# Altium schematic sheet 600米舵机驱动接口板v1.0.SchDoc
size A4; SheetNumber: 1; SheetTotal: 1
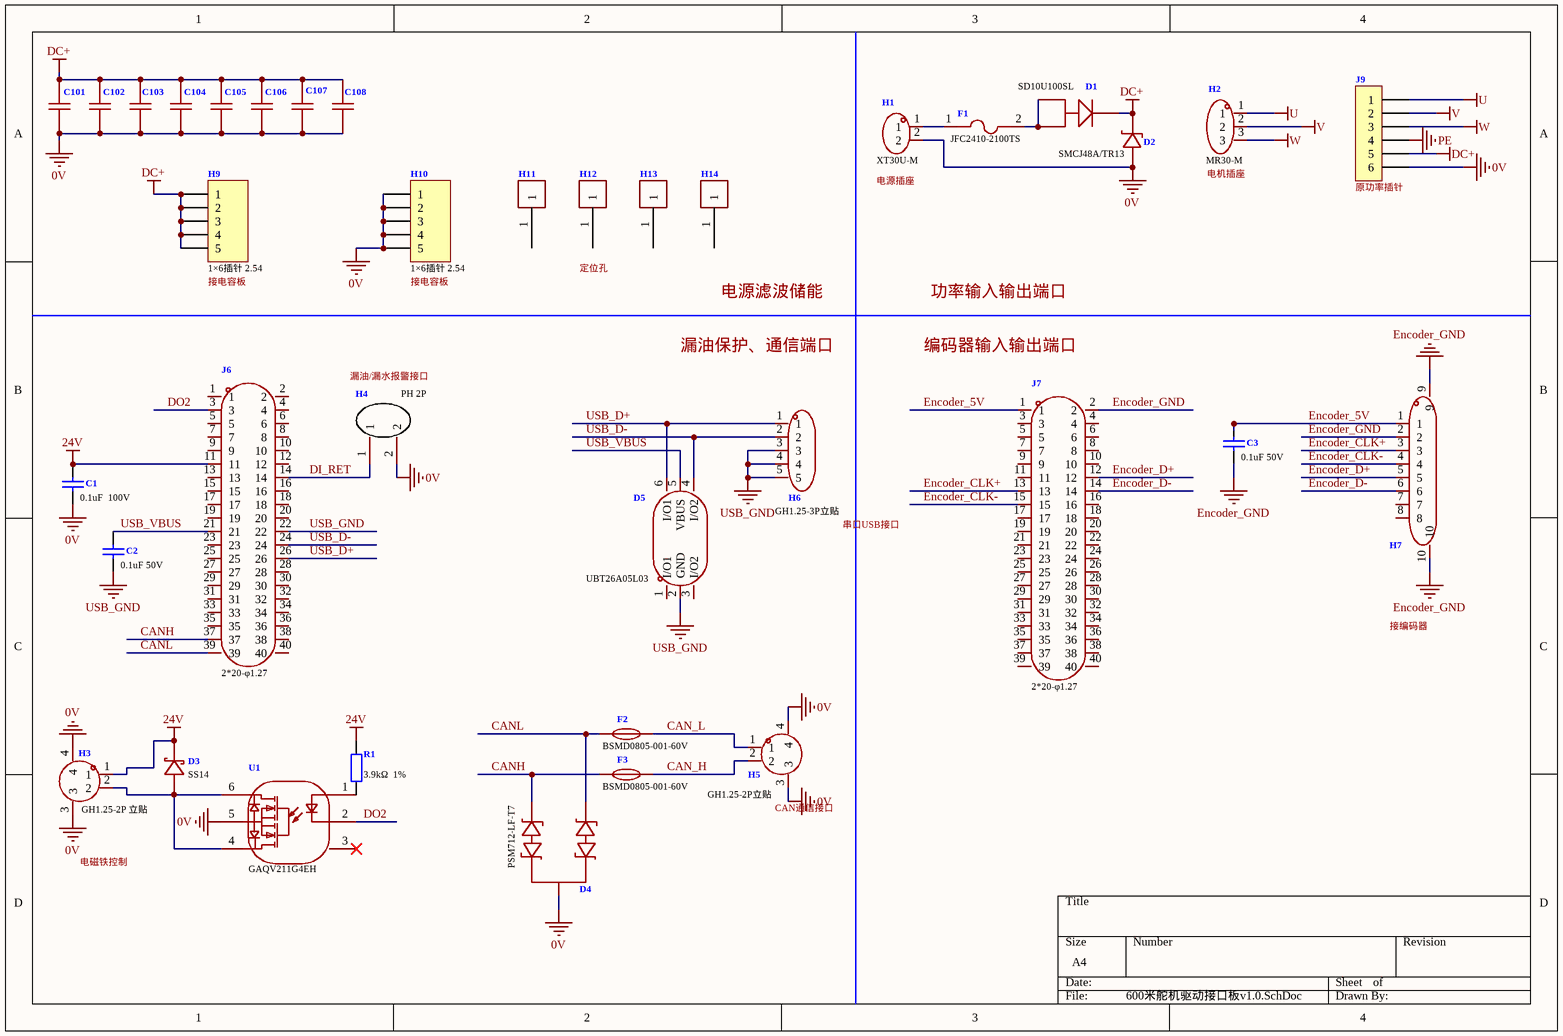
[diagram p0: 600米舵机驱动接口板v1.0.SchDoc]

## Parts
C1  0.1uF  100V  [0805_C]
C2  0.1uF 50V  [0805_C]
C3  0.1uF 50V  [0805_C]
C101  4.7uf 100V  [1210_C]  (value not drawn)
C102  4.7uf 100V  [1210_C]  (value not drawn)
C103  4.7uf 100V  [1210_C]  (value not drawn)
C104  4.7uf 100V  [1210_C]  (value not drawn)
C105  4.7uf 100V  [1210_C]  (value not drawn)
C106  4.7uf 100V  [1210_C]  (value not drawn)
C107  4.7uf 100V  [1210_C]  (value not drawn)
C108  4.7uf 100V  [1210_C]  (value not drawn)
D1  SD10U100SL  [TO-227B-SMD_L6.1-W4.3-LS7.0-RD]
D2  SMCJ48A/TR13  [SMC_L7.1-W6.2-LS8.1-FD]
D3  SS14  [SMAF_L3.5-W2.6-LS4.7-FD]
D4  PSM712-LF-T7  [SOT-23(SOT-23-3)]
D5  UBT26A05L03  [SOT-23-6_L2.9-W1.6-P0.95-LS2.8-BR]
F1  JFC2410-2100TS  [F2410]
F2  BSMD0805-001-60V  [F0805]
F3  BSMD0805-001-60V  [F0805]
H1  XT30U-M  [CONN-TH_XT30U-M-PCB]
H2  MR30-M  [CONN-TH_MR30-M-PCB]
H3  GH1.25-2P 立贴  [CONN-TH_2P-P1.25_XUNPU_WAFER-GH1.25-2PLB]
H4  PH 2P  [CONN-TH_B2B-PH-K-S]
H5  GH1.25-2P立贴  [CONN-TH_2P-P1.25_XUNPU_WAFER-GH1.25-2PLB]
H6  GH1.25-3P立贴  [CONN-SMD_3P-P1.25_GH1.25-3PLTPZ]
H7  SM08B-SURS-TF(LF)(SN)  [CONN-SMD_SM08B-SURS-TF]  (value not drawn)
H9  1×6插针 2.54  [HDR1X5]
H10  1×6插针 2.54  [HDR1X5]
H11  定位孔  [Hole-2.5×3.5]  (value not drawn)
H12  定位孔  [Hole-2.5×3.5]  (value not drawn)
H13  定位孔  [Hole-2.5×3.5]  (value not drawn)
H14  定位孔  [Hole-2.5×3.5]  (value not drawn)
J6  2*20-φ1.27  [HDR-TH_40P-P1.27-V-M-R2-C20-S1.27-ISMC]
J7  2*20-φ1.27  [HDR-TH_40P-P1.27-V-M-R2-C20-S1.27-ISMC]
J9  φ1.3  [ISMC_Power]  (value not drawn)
R1  3.9kΩ  1%  [0805_R]
U1  GAQV211G4EH  [SMD-6_L8.8-W6.4-P2.54-LS9.6-BL]

## Nets
0V: C1.1 C101.1 C102.1 C103.1 C104.1 C105.1 C106.1 C107.1 C108.1 D2.1(A) D4.3(K) H1.2 H3.3 H3.4 H4.2 H5.3 H5.4 H10.1 H10.2 H10.3 H10.4 H10.5 J9.6 U1.5
24V: C1.2 D3.2(K) H3.1 J6.11 R1.1
DC+: C101.2 C102.2 C103.2 C104.2 C105.2 C106.2 C107.2 C108.2 D1.3 D2.2(K) H9.1 H9.2 H9.3 H9.4 H9.5 J9.5
Encoder_GND: C3.1 H7.2 H7.9 H7.10 J7.2
PE: J9.4
U: H2.1 J9.1
USB_GND: C2.1 D5.2(GND) H6.3 H6.4 H6.5 J6.22
V: H2.2 J9.2
W: H2.3 J9.3
CAN_H: F3.2 H5.2
CAN_L: F2.2 H5.1
CANH: D4.2(A1) F3.1 J6.37
CANL: D4.1(A1) F2.1 J6.39
DI_RET: H4.1 J6.14
DO2: J6.3 U1.2
Encoder_5V: C3.2 H7.1 J7.1
Encoder_CLK+: H7.3 J7.13
Encoder_CLK-: H7.4 J7.15
Encoder_D+: H7.5 J7.12
Encoder_D-: H7.6 J7.14
USB_D+: D5.6(I/O1) H6.1 J6.26
USB_D-: D5.4(I/O2) H6.2 J6.24
USB_VBUS: C2.2 D5.5(VBUS) J6.21
NetD1_1: D1.1 D1.2 F1.2
NetD3_1: D3.1(A) H3.2 U1.4 U1.6
NetF1_1: F1.1 H1.1
NetR1_2: R1.2 U1.1

Not connected (* = marked no-connect by the designer): D5 1(I/O1) 3(I/O2); H7 7 8; H11 1; H12 1; H13 1; H14 1; J6 1 2 4 5 6 7 8 9 10 12 13 15 16 17 18 19 20 23 25 27 28 29 30 31 32 33 34 35 36 38 40; J7 3 4 5 6 7 8 9 10 11 16 17 18 19 20 21 22 23 24 25 26 27 28 29 30 31 32 33 34 35 36 37 38 39 40; U1 3*

## Notes on the sheet
- (near H2) 电机插座
- (near H1) 电源插座
- (near J9) 原功率插针
- (near H9) 接电容板
- (near H10) 接电容板
- 定位孔
- 电源滤波储能
- 功率输入输出端口
- 漏油/漏水报警接口
- 漏油保护、通信端口
- 编码器输入输出端口
- (near H6) 串口USB接口
- 接编码器
- (near H5) CAN通信接口
- 电磁铁控制

## Library data of the parts
C1-C3 = 0805 1uF (105) 10% 50V: 贴片电容; ComponentLink1Description: 供应商链接; ComponentLink1URL: http://www.szlcsc.com/product/details_29074.html; Package: 0805; Supplier: LC; SuppliersPartNumber: C28323
C101-C108 = 1210 4.7uf: 贴片电容; Manufacturer: FH(风华); Symbol: 1210B475K101NT; Add into BOM: yes; Tolerance: ±10%; Temperature Coefficient: X7R; Device: 1210B475K101NT; LCSC Part Name: 4.7uF ±10% 100V; Supplier Part: C2840282; Manufacturer Part: 1210B475K101NT; Supplier Footprint: 1210; JLCPCB Part Class: Extended Part; Datasheet: https://atta.szlcsc.com/upload/public/pdf/source/20210617/C2840282_5B7AB5BFD77495008CFAB3FC2796A0E9.pdf; Supplier: LCSC; Convert to PCB: yes; Value: 4.7uF; Voltage Rated: 100V
D1 = SD10U100SL: 肖特基二极管; Manufacturer: LGE(鲁光); Add into BOM: yes; Diode Configuration: 独立式; Forward Voltage (Vf@If): 570mV@10A; Reverse Voltage (Vr): 100V; Rectified Current: 10A; Reverse Leakage Current (Ir): 200uA@100V; Symbol: SD10U100SL; Device: SD10U100SL; LCSC Part Name: 电压:100V 电流:10A; Supplier Part: C2903879; Manufacturer Part: SD10U100SL; Supplier Footprint: TO-277; JLCPCB Part Class: Extended Part; Datasheet: https://atta.szlcsc.com/upload/public/pdf/source/20211009/BD93C46FB22A14806A56CC8AAFB52095.pdf; Supplier: LCSC; Convert to PCB: yes
D2 = SMCJ48A/TR13: TVS; Manufacturer: Brightking(君耀电子); Symbol: SMCJ48A_C310056; Add into BOM: yes; Reverse Stand-Off Voltage (Vrwm): 48V; Maximum Clamping Voltage: 77.4V; Peak Pulse Current (Ipp): 19.4A; Peak Pulse Power Dissipation (Ppp): 1.5kW; Breakdown Voltage: 53.3V; Device: SMCJ48A/TR13; LCSC Part Name: SMCJ48A/TR13; Supplier Part: C310056; Manufacturer Part: SMCJ48A/TR13; Supplier Footprint: SMC(DO-214AB); JLCPCB Part Class: Extended Part; Datasheet: https://atta.szlcsc.com/upload/public/pdf/source/20181127/C310089_DF11A7ED4CCF9CC3586EB1D10F86E9D6.pdf; Supplier: LCSC; Convert to PCB: yes; Type: TVS
D3 = SS34F_C908669: Manufacturer: GOODWORK(固得沃克); Manufacturer Part: SS34F; Add into BOM: yes; Diode Configuration: 独立式; Forward Voltage (Vf@If): 550mV@3A; Reverse Voltage (Vr): 40V; Average Rectified Current (Io): 3A; Reverse Leakage Current (Ir): 200uA@40V; Symbol: SS34F_C908669; Device: SS34F_C908669; LCSC Part Name: 电压:40V 电流:3A; Supplier Part: C908669; Supplier Footprint: SMAF; JLCPCB Part Class: Extended Part; Datasheet: https://atta.szlcsc.com/upload/public/pdf/source/20201231/C908669_14F884D2643FB3EE455C9EAA3A20B275.pdf; Supplier: LCSC; Convert to PCB: yes
D4 = PSM712-LF-T7: 双向TVS; Manufacturer: PROTEK; Add into BOM: yes; Reverse Stand-Off Voltage (Vrwm): 12V; Clamping Voltage: 19V; Voltage - Breakdown: 13.3V; Type: TVS; Symbol: PSM712-LF-T7; Device: PSM712-LF-T7; LCSC Part Name: PSM712-LF-T7; Supplier Part: C32677; Manufacturer Part: PSM712-LF-T7; Supplier Footprint: SOT-23; JLCPCB Part Class: Basic Part; Datasheet: https://atta.szlcsc.com/upload/public/pdf/source/20140717/1457707154667.pdf; Supplier: LCSC; Convert to PCB: yes
D5 = UBT26A05L03: TVS; Manufacturer: Brightking(君耀电子); Add into BOM: yes; Maximum Clamping Voltage: 17V; Breakdown Voltage: 6V; Number of Lines: 双路; Type: ESD; Symbol: UBT26A05L03; Device: UBT26A05L03; LCSC Part Name: UBT26A05L03; Supplier Part: C523544; Manufacturer Part: UBT26A05L03; Supplier Footprint: SOT-23-6L; JLCPCB Part Class: Extended Part; Datasheet: https://atta.szlcsc.com/upload/public/pdf/source/20200427/C523544_824ACAC2A221CAA635828872F8565CA9.pdf; Supplier: LCSC; Convert to PCB: yes
F1 = JFC2410-2100TS: 保险管; Manufacturer: JDTfuse(集电通); Add into BOM: yes; Type: 贴片式保险丝; Current Rating: 10A; Voltage Rating  (AC): 125V; Breaking Capacity: 50A; Symbol: JFC2410-2100TS; Device: JFC2410-2100TS; LCSC Part Name: 10A 125V 贴片式保险丝 慢断; Supplier Part: C136391; Manufacturer Part: JFC2410-2100TS; Supplier Footprint: SMD; JLCPCB Part Class: Extended Part; Datasheet: https://atta.szlcsc.com/upload/public/pdf/source/20230515/1D43BDD82FA89335B41B370141760CD9.pdf; Supplier: LCSC; Convert to PCB: yes; Voltage Rating (DC): 125V; Operating Temperature: -55℃~+125℃
F2 F3 = BSMD0805-001-60V: 自恢复保险; Manufacturer: BHFUSE(佰宏); Add into BOM: yes; Operating Voltage (Max): 60V; Current Rating (Max): 30A; Hold Current: 10mA; Trip Current: 50mA; Power Dissipation: 500mW; Resistance - Initial (Ri) (Min): 15Ω; Resistance - Post Trip (R1) (Max): 100Ω; Maximum Time to Trip: 1.5s; Symbol: BSMD0805-001-60V; Device: BSMD0805-001-60V; LCSC Part Name: 60V 10mA 0805自恢复; Supplier Part: C5222212; Manufacturer Part: BSMD0805-001-60V; Supplier Footprint: 0805; JLCPCB Part Class: Extended Part; Datasheet: https://atta.szlcsc.com/upload/public/pdf/source/20230512/7A46D6CD923C15CBB98FD769C08EDD80.pdf; Supplier: LCSC; Convert to PCB: yes
H1 = XT30U-M: Manufacturer: AMASS(艾迈斯); Add into BOM: yes; Brand: 艾迈斯; InterfaceType: 公头; Symbol: XT30U-M; Device: XT30U-M; LCSC Part Name: AMASS(艾迈斯)轻量版锂电池插头公头 XT30U-M; Supplier Part: C99101; Manufacturer Part: XT30U-M; Supplier Footprint: -; JLCPCB Part Class: Extended Part; Datasheet: https://atta.szlcsc.com/upload/public/pdf/source/20170606/1496716542582.pdf; Supplier: LCSC; Convert to PCB: yes; Model: XT30U-M; Power: -; Output: -; Input: -; Size: -; Interface: -; Type: 插头; Colour: 黄色; MaximumCurrent: -; RatedVoltage: -; Type1: -; NumberOfUSBHoles: -; MetalMaterial: -; InsulationMaterial: -; RatedCurrent: -; RecommendedWireGauge: -; FlameRetardantGrade: -; contact resistance: -; Belt length: -; specifications: -
H2 = MR30-M: Manufacturer: AMASS(艾迈斯); Add into BOM: yes; Brand: 艾迈斯; InterfaceType: 公头; specifications: 3pin; Symbol: MR30-M; Device: MR30-M; LCSC Part Name: AMASS(艾迈斯)锂电池三芯电源连接器公头MR30-M 2件套; Supplier Part: C99873; Manufacturer Part: MR30-M; Supplier Footprint: -; JLCPCB Part Class: Extended Part; Datasheet: https://atta.szlcsc.com/upload/public/pdf/source/20170412/1491969315720.pdf; Supplier: LCSC; Convert to PCB: yes; Model: MR30-M; Power: -; Output: -; Input: -; Size: -; Interface: -; Type: 航空插头; Colour: -; MaximumCurrent: -; RatedVoltage: -; Type1: -; NumberOfUSBHoles: -; MetalMaterial: -; InsulationMaterial: -; RatedCurrent: -; RecommendedWireGauge: -; FlameRetardantGrade: -; contact resistance: -; Belt length: -
H3 = WAFER-GH1.25-2PLB: Manufacturer: XUNPU(讯普); Add into BOM: yes; Pins Structure: 1x2P; Pitch: 1.25mm; Reference Series: GH; Number of PINs Per Row: 2; Current Rating (Max): 1A; Symbol: WAFER-GH1.25-2PLB; Device: WAFER-GH1.25-2PLB; LCSC Part Name: 1x2P 间距:1.25mm 立贴 系列:GH; Supplier Part: C3029368; Manufacturer Part: WAFER-GH1.25-2PLB; Supplier Footprint: SMD,P=1.25mm; JLCPCB Part Class: Extended Part; Datasheet: https://atta.szlcsc.com/upload/public/pdf/source/20220527/44F824AAC8C2B617205E15955FF9C23D.pdf; Supplier: LCSC; Convert to PCB: yes; Mounting Style: 立贴; Number of Pins: 2P; Number of Rows: 1; Operating Temperature Range: -25℃~+85℃
H4 = PH2.0-2P: 端子; Manufacturer: JST; Name: B2B-PH-K-S(LF)(SN); Add into BOM: yes; Pitch: 2mm; Pins Structure: 1x2P; Number of PINs Per Row: 2; Symbol: B2B-PH-K-S(LF)(SN); Device: B2B-PH-K-S(LF)(SN); LCSC Part Name: B2B-PH-K-S(LF)(SN); Supplier Part: C131337; Manufacturer Part: B2B-PH-K-S(LF)(SN); Supplier Footprint: 插件; JLCPCB Part Class: Extended Part; Datasheet: https://atta.szlcsc.com/upload/public/pdf/source/20171026/C131337_15089839672461058811.pdf; Supplier: LCSC; Convert to PCB: yes; Reference Series: PH; Number of Rows: 1; Row Spacing: -; Mounting Style: -; Contact Material: 黄铜
H5 = WAFER-GH1.25-2PLB: 连接器; Manufacturer: XUNPU(讯普); Add into BOM: yes; Pins Structure: 1x2P; Pitch: 1.25mm; Reference Series: GH; Number of PINs Per Row: 2; Current Rating (Max): 1A; Symbol: WAFER-GH1.25-2PLB; Device: WAFER-GH1.25-2PLB; LCSC Part Name: 1x2P 间距:1.25mm 立贴 系列:GH; Supplier Part: C3029368; Manufacturer Part: WAFER-GH1.25-2PLB; Supplier Footprint: SMD,P=1.25mm; JLCPCB Part Class: Extended Part; Datasheet: https://atta.szlcsc.com/upload/public/pdf/source/20220527/44F824AAC8C2B617205E15955FF9C23D.pdf; Supplier: LCSC; Convert to PCB: yes; Mounting Style: 立贴; Number of Pins: 2P; Number of Rows: 1; Operating Temperature Range: -25℃~+85℃
H6 = GH1.25-3PLTPZ: 连接器; Manufacturer: BOOMELE(博穆精密); Add into BOM: yes; Symbol: GH1.25-3PLTPZ; Device: GH1.25-3PLTPZ; LCSC Part Name: GH1.25-3P立贴编带加盖; Supplier Part: C2829261; Manufacturer Part: GH1.25-3PLTPZ; Supplier Footprint: -; JLCPCB Part Class: Extended Part; Datasheet: https://atta.szlcsc.com/upload/public/pdf/source/20211125/08A09A4909F58AF780B71FE423A00F7E.pdf; Supplier: LCSC; Convert to PCB: yes
H7 = SM08B-SURS-TF(LF)(SN): 连接器; Manufacturer: JST; Add into BOM: yes; Pins Structure: 1x8P; Pitch: 0.8mm; Reference Series: SUR; Number of PINs Per Row: 8; Current Rating (Max): 500mA; Rated Voltage (Max): 30V; Plastic Material: PA; Flame Retardant Rating: UL94V-0; Supplementary Features: 辅助焊脚; Z-Height of the Board: 1.75mm; X-Length of Bottom Edge on Board (Spacing Line): 8.6mm; Y-Width of Bottom Edge on Board: 2.7mm; Symbol: SM08B-SURS-TF(LF)(SN); Device: SM08B-SURS-TF(LF)(SN); LCSC Part Name: 1x8P 间距:0.8mm 卧贴 系列:SUR; Supplier Part: C595161; Manufacturer Part: SM08B-SURS-TF(LF)(SN); Supplier Footprint: SMD,P=0.8mm,卧贴; JLCPCB Part Class: Extended Part; Datasheet: https://atta.szlcsc.com/upload/public/pdf/source/20211104/F9E1F8CA9D999D7845259FE213F9F750.pdf; Supplier: LCSC; Convert to PCB: yes; Mounting Style: 卧贴; Number of Pins: 8P; Number of Rows: 1; Row Spacing: -; Contact Material: 铜合金; Contact Plating: 锡; Operating Temperature Range: -25℃~+85℃; Colour: 白色
H9 H10 = Header 5: Header, 5-Pin; LatestRevisionDate: 17-Jul-2002; LatestRevisionNote: Re-released for DXP Platform.; Publisher: Altium Limited
H11-H14 = Hole
J6 J7 = 2.0-2*20PM: 插针孔; Manufacturer: BOOMELE(博穆精密); Symbol: 直排母2*20p; Add into BOM: yes; Pitch: 2mm; Number of Holes: 40P; Device: 2.0-2*20PM; LCSC Part Name: 间距:2mm 直插; Supplier Part: C110426; Manufacturer Part: 2.0-2*20PM; Supplier Footprint: 插件,P=2mm; JLCPCB Part Class: Extended Part; Datasheet: https://atta.szlcsc.com/upload/public/pdf/source/20230330/72429EBD17B7DF6EF48873C4D9CA2FEF.pdf; Supplier: LCSC; Convert to PCB: yes; Holes Structure: -; Row Spacing: 2mm; Circular Hole / Square Hole: -; Mounting Type: 直插; Number of Rows: 双排; Current Rating (Max): -; Voltage Rating (Max): -; Holes Direction: -; Insulation Height: -; Contact Material: -; Contact Plating: -; Operating Temperature Range: -; Soldering Temperature(Max): -
J9 = Pin HDR1X6: 插针孔
R1 = 0805 82Ω (82R0) 1%: 贴片电阻; ComponentLink1Description: 供应商链接; ComponentLink1URL: http://www.szlcsc.com/product/details_18529.html
U1 = GAQV211G4EH: Manufacturer: SUPSiC(国晶微半导体); Add into BOM: yes; Voltage - Forward(Vf): 1.2V; Load Voltage: 40V; Load Current: 4.5A; RDS(on): 33mΩ; Turn-on time: 1.5ms; Turn-off time: 50us; Symbol: GAQV211G4EH; Device: GAQV211G4EH; LCSC Part Name: GAQV211G4EH 1 Form A(SPST-NO) 负载电压:40V 连续负载电流:4.5A; Supplier Part: C7435166; Manufacturer Part: GAQV211G4EH; Supplier Footprint: SMD-6; JLCPCB Part Class: Extended Part; Datasheet: https://atta.szlcsc.com/upload/public/pdf/source/20241011/CA0590B664AED94D4C3AAC21686DAD45.pdf; Supplier: LCSC; Convert to PCB: yes; Contact Form: -; Load Type: -; Isolation Voltage(Vrms): -